# Altium project VNA_CHANNEL2.PrjPcb
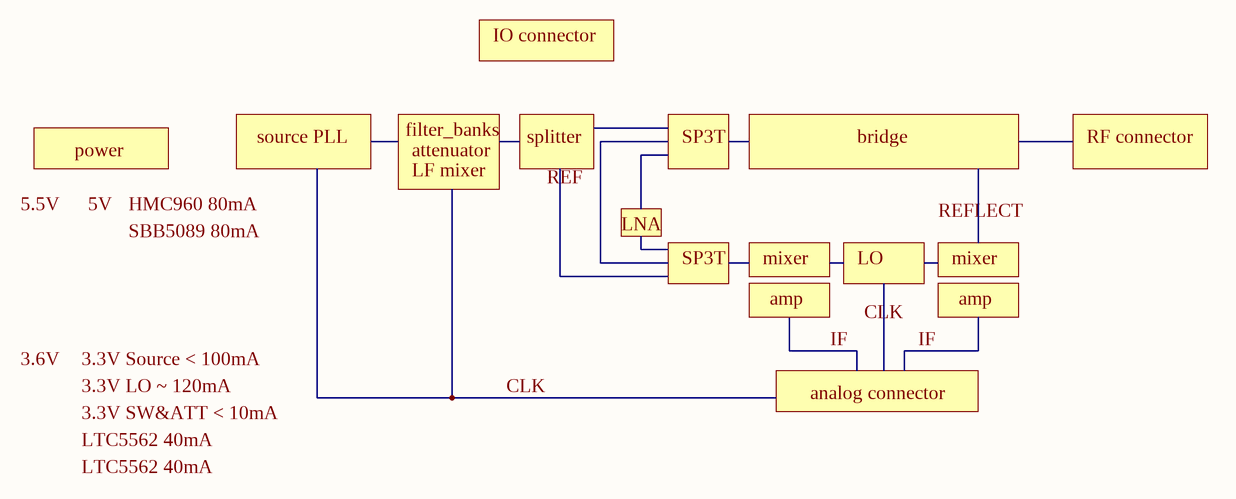
[diagram p0: block_diagram.SchDoc]
6 sheets, 107 parts. Net scope: flat (ports and power ports of the same name join across sheets).
Board file: VNA_CHANNEL2.PcbDoc
Sheets:
  block_diagram.SchDoc
  connector.SchDoc
  filterbank_amp.SchDoc
  bridge.SchDoc
  LO.SchDoc
  mixer.SchDoc

## Sheet block_diagram.SchDoc
size A4

### Notes on the sheet
- IO connector
- power
- source PLL
- filter_banks
- attenuator
- LF mixer
- splitter
- REF
- SP3T
- bridge
- RF connector
- 5.5V
- 5V
- HMC960 80mA
- SBB5089 80mA
- LNA
- mixer
- LO
- REFLECT
- amp
- CLK
- 3.6V
- 3.3V Source < 100mA
- 3.3V LO ~ 120mA
- analog connector
- IF
- LTC5562 40mA
- 3.3V SW&ATT < 10mA

## Sheet connector.SchDoc
size A4
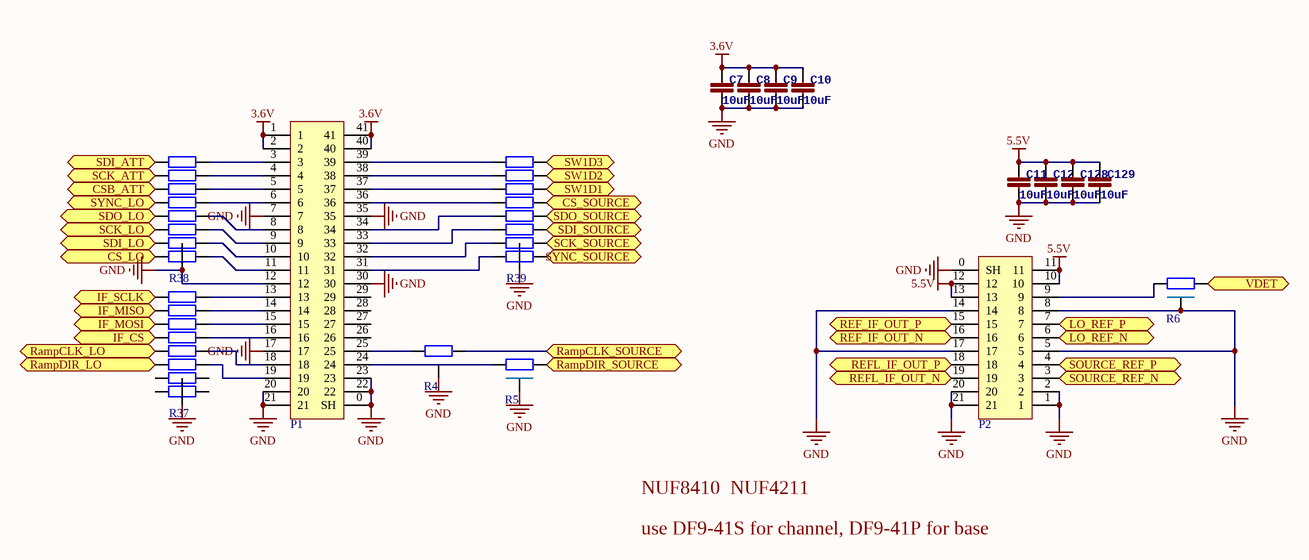
[diagram p1: connector.SchDoc]

### Parts
C7  10uF  [0603L]
C8  10uF  [0603L]
C9  10uF  [0603L]
C10  10uF  [0603L]
C11  10uF  [0603L]
C12  10uF  [0603L]
C128  10uF  [0603L]
C129  10uF  [0603L]
P1  DF9-41S  [DF9-41S]  (value not drawn)
P2  DF9-21  [DF9-21S]  (value not drawn)
R4  PiFilter  [PiFIiter]  (value not drawn)
R5  PiFilter  [PiFIiter]  (value not drawn)
R6  PiFilter  [PiFIiter]  (value not drawn)
R37  NUF8xxx  [NUF8xxx]  (value not drawn)
R38  NUF8xxx  [NUF8xxx]  (value not drawn)
R39  NUF8xxx  [NUF8xxx]  (value not drawn)

### Ports
CS_LO, CS_SOURCE, CSB_ATT, IF_CS, IF_MISO, IF_MOSI, IF_SCLK, LO_REF_N, LO_REF_P, RampCLK_LO, RampCLK_SOURCE, RampDIR_LO, RampDIR_SOURCE, REF_IF_OUT_N, REF_IF_OUT_P, REFL_IF_OUT_N, REFL_IF_OUT_P, SCK_ATT, SCK_LO, SCK_SOURCE, SDI_ATT, SDI_LO, SDI_SOURCE, SDO_LO, SDO_SOURCE, SOURCE_REF_N, SOURCE_REF_P, SW1D1, SW1D2, SW1D3, SYNC_LO, SYNC_SOURCE, VDET

### Nets
3.6V: C7.2 C8.2 C9.2 C10.2 P1.1 P1.2 P1.40 P1.41
5.5V: C11.2 C12.2 C128.2 C129.2 P2.10 P2.11 P2.12 P2.13
GND: C7.1 C8.1 C9.1 C10.1 C11.1 C12.1 C128.1 C129.1 P1.0(SH) P1.7 P1.12 P1.17 P1.20 P1.21 P1.22 P1.23 P1.30 P1.35 P2.0(SH) P2.1 P2.2 P2.5 P2.8 P2.14 P2.17 P2.20 P2.21 R4.3 R5.3 R6.3 R37.0 R38.0 R39.0
LO_REF_N: P2.6 ; port LO_REF_N
LO_REF_P: P2.7 ; port LO_REF_P
NetP1_3: P1.3 R38.16
NetP1_4: P1.4 R38.15
NetP1_5: P1.5 R38.14
NetP1_6: P1.6 R38.13
NetP1_8: P1.8 R38.12
NetP1_9: P1.9 R38.11
NetP1_10: P1.10 R38.10
NetP1_11: P1.11 R38.9
NetP1_13: P1.13 R37.16
NetP1_14: P1.14 R37.15
NetP1_15: P1.15 R37.14
NetP1_16: P1.16 R37.13
NetP1_18: P1.18 R37.12
NetP1_19: P1.19 R37.11
NetP1_24: P1.24 R5.1
NetP1_25: P1.25 R4.2
NetP1_31: P1.31 R39.8
NetP1_32: P1.32 R39.7
NetP1_33: P1.33 R39.6
NetP1_34: P1.34 R39.5
NetP1_36: P1.36 R39.4
NetP1_37: P1.37 R39.3
NetP1_38: P1.38 R39.2
NetP1_39: P1.39 R39.1
NetP2_3: P2.3 ; port SOURCE_REF_N
NetP2_4: P2.4 ; port SOURCE_REF_P
NetP2_9: P2.9 R6.2
NetP2_15: P2.15 ; port REF_IF_OUT_P
NetP2_16: P2.16 ; port REF_IF_OUT_N
NetP2_18: P2.18 ; port REFL_IF_OUT_P
NetP2_19: P2.19 ; port REFL_IF_OUT_N
NetR4_1: R4.1 ; port RampCLK_SOURCE
NetR5_2: R5.2 ; port RampDIR_SOURCE
NetR6_1: R6.1 ; port VDET
NetR37_1: R37.1 ; port IF_SCLK
NetR37_2: R37.2 ; port IF_MISO
NetR37_3: R37.3 ; port IF_MOSI
NetR37_4: R37.4 ; port IF_CS
NetR37_5: R37.5 ; port RampCLK_LO
NetR37_6: R37.6 ; port RampDIR_LO
NetR38_1: R38.1 ; port SDI_ATT
NetR38_2: R38.2 ; port SCK_ATT
NetR38_3: R38.3 ; port CSB_ATT
NetR38_4: R38.4 ; port SYNC_LO
NetR38_5: R38.5 ; port SDO_LO
NetR38_6: R38.6 ; port SCK_LO
NetR38_7: R38.7 ; port SDI_LO
NetR38_8: R38.8 ; port CS_LO
NetR39_9: R39.9 ; port SYNC_SOURCE
NetR39_10: R39.10 ; port SCK_SOURCE
NetR39_11: R39.11 ; port SDI_SOURCE
NetR39_12: R39.12 ; port SDO_SOURCE
NetR39_13: R39.13 ; port CS_SOURCE
NetR39_14: R39.14 ; port SW1D1
NetR39_15: R39.15 ; port SW1D2
NetR39_16: R39.16 ; port SW1D3

Not connected (* = marked no-connect by the designer): P1 26 27 28 29; R37 7 8 9 10

### Notes on the sheet
- use DF9-41S for channel, DF9-41P for base
- NUF8410  NUF4211

### Library data of the parts
C7-C12 C128 C129 = CAP0402-CAP: <b>Capacitor</b> / Standard 0603 ceramic capacitor, and 0.1" leaded capacitor.; PARTNO: CC0402ZRY5V7BB104

## Sheet filterbank_amp.SchDoc
size A3
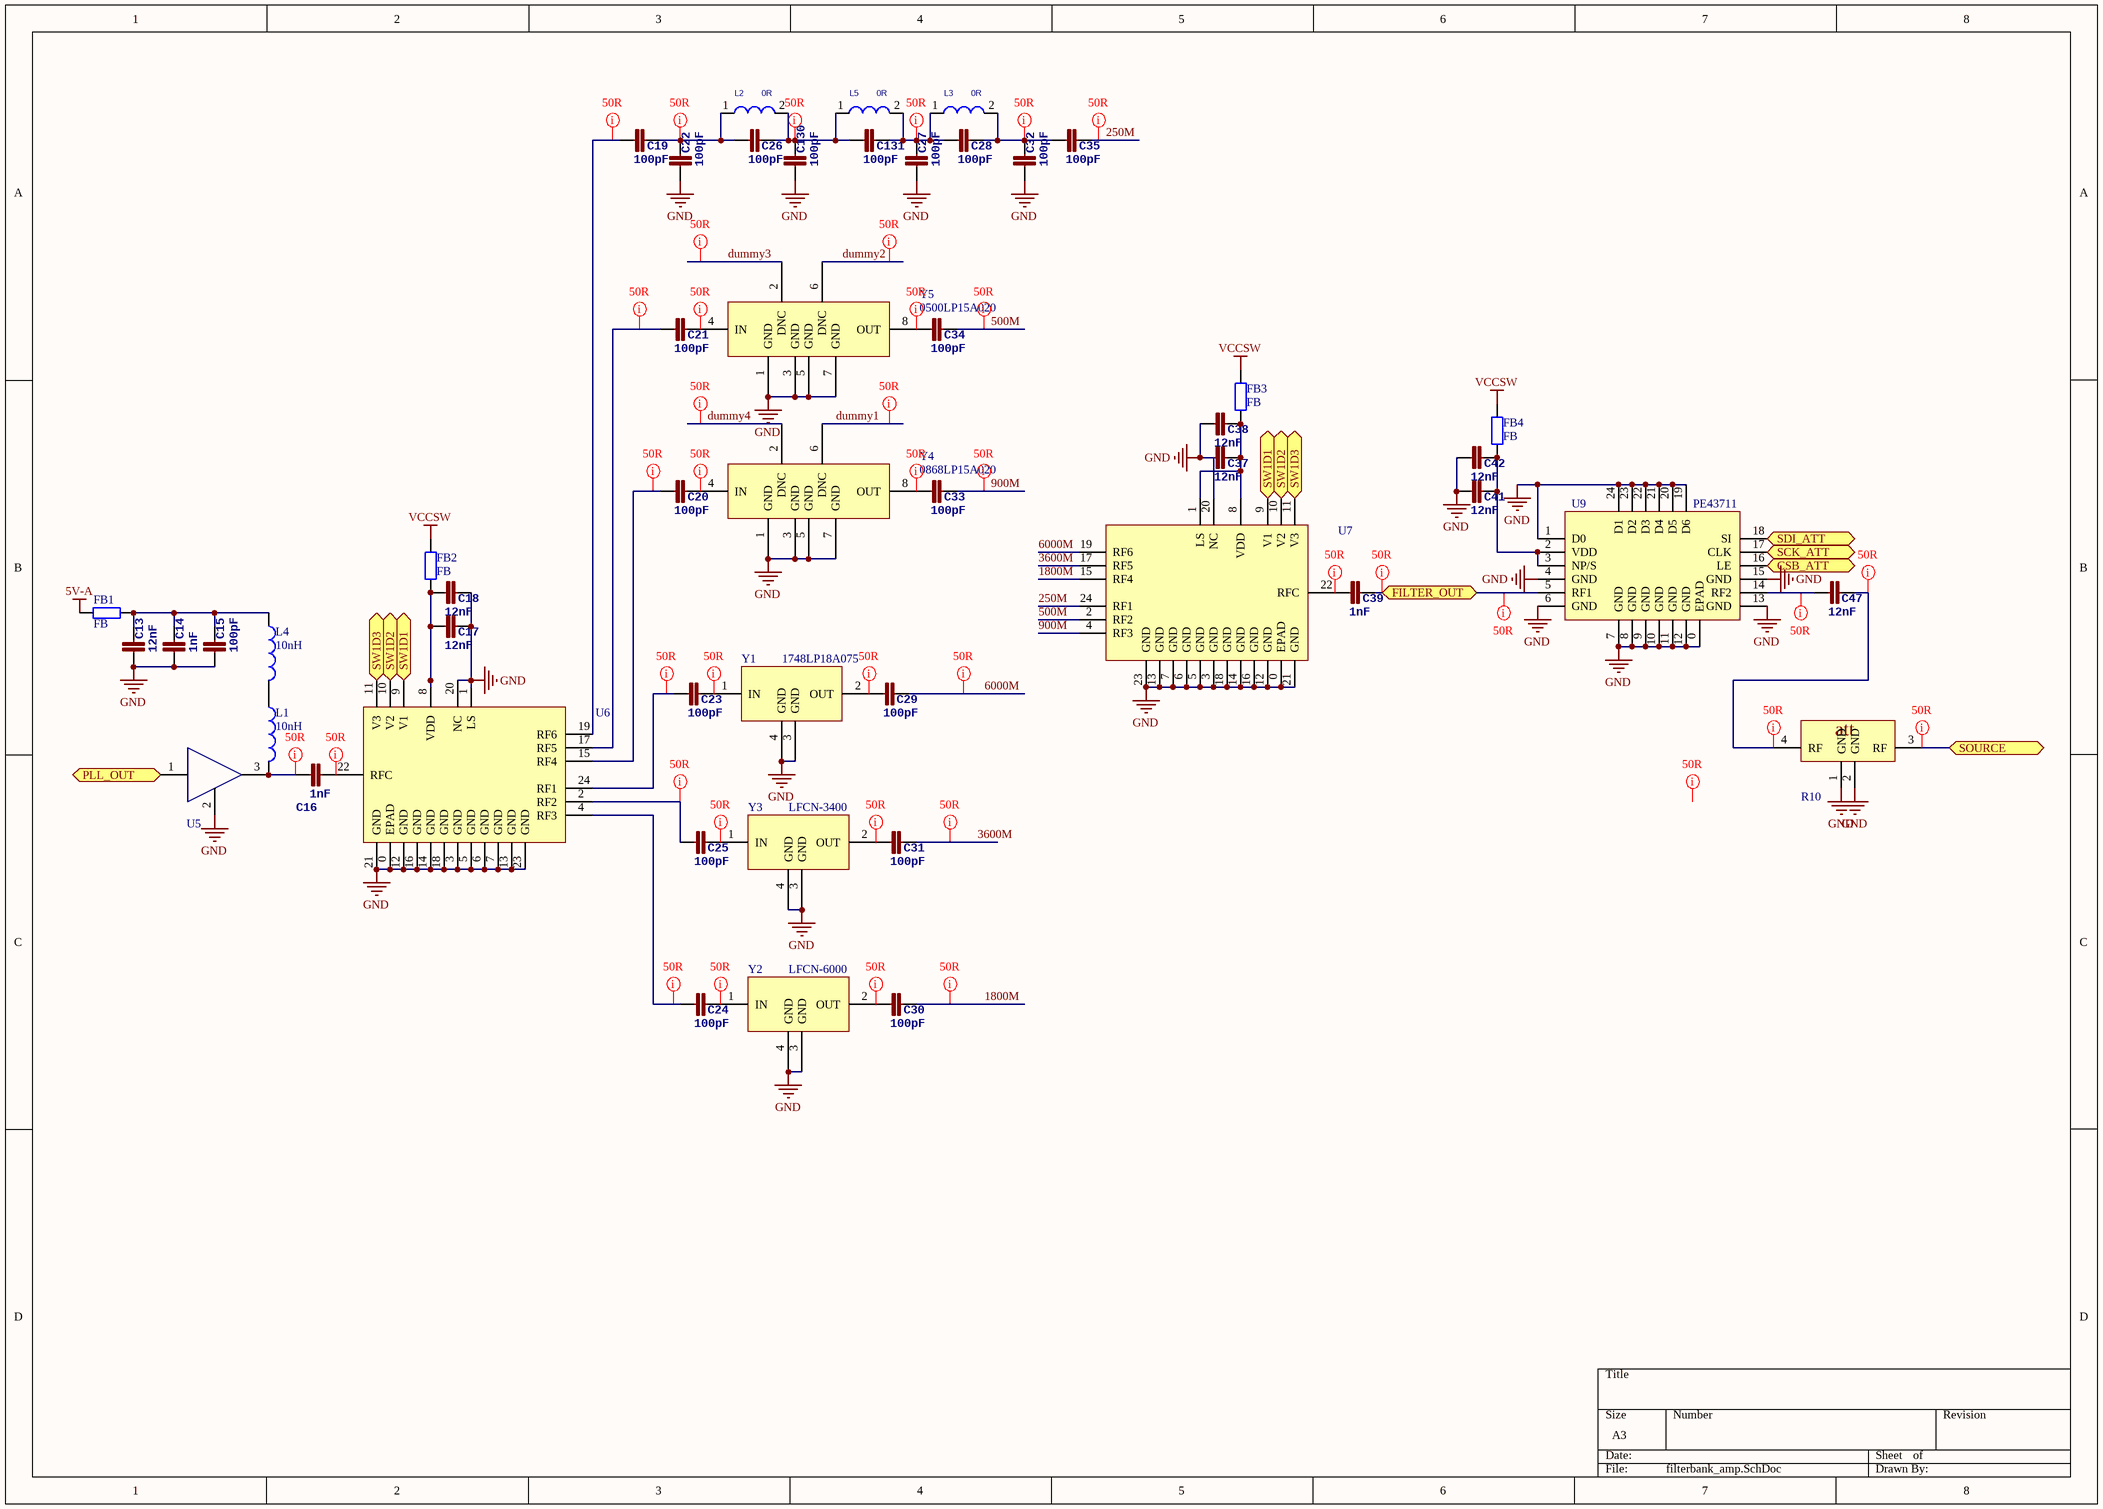
[diagram p2: filterbank_amp.SchDoc]

### Parts
C13  12nF  [0805]
C14  1nF  [0402]
C15  100pF  [0402]
C16  1nF  [0402]
C17  12nF  [0402]
C18  12nF  [0402]
C19  100pF  [0402]
C20  100pF  [0402]
C21  100pF  [0402]
C22  100pF  [0402]
C23  100pF  [0402]
C24  100pF  [0402]
C25  100pF  [0402]
C26  100pF  [0402]
C27  100pF  [0402]
C28  100pF  [0402]
C29  100pF  [0402]
C30  100pF  [0402]
C31  100pF  [0402]
C32  100pF  [0402]
C33  100pF  [0402]
C34  100pF  [0402]
C35  100pF  [0402]
C37  12nF  [0402]
C38  12nF  [0402]
C39  1nF  [0402]
C41  12nF  [0402]
C42  12nF  [0402]
C47  12nF  [0201]
C130  100pF  [0402]
C131  100pF  [0402]
FB1  FB  [0402]
FB2  FB  [0402]
FB3  FB  [0402]
FB4  FB  [0402]
L1  value 10nH  [0402]  (hidden comment: Inductor)
L2  0R  [0402]
L3  0R  [0402]
L4  value 10nH  [0603]  (hidden comment: Inductor)
L5  0R  [0402]
R10  EXB24-RF-ATT  [EXB24AT-RF-ATT]  (value not drawn)
U5  AMP-SOT89  [SOT-89]  (value not drawn)
U6  PE42462  [PE42462]  (value not drawn)
U7  PE42462  [PE42462]  (value not drawn)
U9  PE43711  [PE43711]
Y1  1748LP18A075  [1748LP18A075]
Y2  LFCN-6000  [1748LP18A075]
Y3  LFCN-3400  [1748LP18A075]
Y4  0868LP15A020  [5515LP15A730/0868LP15A020]
Y5  0500LP15A020  [5515LP15A730/0868LP15A020]

### Ports
CSB_ATT, FILTER_OUT, PLL_OUT, SCK_ATT, SDI_ATT, SOURCE, SW1D1, SW1D2, SW1D3

### Nets
5V-A: FB1.1
GND: C13.1 C14.1 C15.1 C17.2 C18.2 C22.1 C27.1 C32.1 C37.1 C38.1 C41.1 C42.1 C130.1 R10.1(GND) R10.2(GND) U5.2 U6.0(EPAD) U6.1(LS) U6.3(GND) U6.5(GND) U6.6(GND) U6.7(GND) U6.12(GND) U6.13(GND) U6.14(GND) U6.16(GND) U6.18(GND) U6.20(NC) U6.21(GND) U6.23(GND) U7.0(EPAD) U7.3(GND) U7.5(GND) U7.6(GND) U7.7(GND) U7.12(GND) U7.13(GND) U7.14(GND) U7.16(GND) U7.18(GND) U7.20(NC) U7.21(GND) U7.23(GND) U9.0(EPAD) U9.1(D0) U9.4(GND) U9.6(GND) U9.7(GND) U9.8(GND) U9.9(GND) U9.10(GND) U9.11(GND) U9.12(GND) U9.13(GND) U9.15(GND) U9.19(D6) U9.20(D5) U9.21(D4) U9.22(D3) U9.23(D2) U9.24(D1) Y1.3(GND) Y1.4(GND) Y2.3(GND) Y2.4(GND) Y3.3(GND) Y3.4(GND) Y4.1(GND) Y4.3(GND) Y4.5(GND) Y4.7(GND) Y5.1(GND) Y5.3(GND) Y5.5(GND) Y5.7(GND)
VCCSW: FB2.2 FB3.2 FB4.2
250M: C35.2 U7.24(RF1)
500M: C34.2 U7.2(RF2)
900M: C33.2 U7.4(RF3)
1800M: C30.2 U7.15(RF4)
3600M: C31.2 U7.17(RF5)
6000M: C29.2 U7.19(RF6)
dummy1: Y4.6(DNC)
dummy2: Y5.6(DNC)
dummy3: Y5.2(DNC)
dummy4: Y4.2(DNC)
NetB1_SOURCE: R10.3(RF) ; port SOURCE
NetC13_2: C13.2 C14.2 C15.2 FB1.2 L4.1
NetC16_1: C16.1 L1.2 U5.3
NetC16_2: C16.2 U6.22(RFC)
NetC17_1: C17.1 C18.1 FB2.1 U6.8(VDD)
NetC19_1: C19.1 U6.19(RF6)
NetC19_2: C19.2 C22.2 C26.1 L2.1
NetC20_1: C20.1 U6.15(RF4)
NetC20_2: C20.2 Y4.4(IN)
NetC21_1: C21.1 U6.17(RF5)
NetC21_2: C21.2 Y5.4(IN)
NetC23_1: C23.1 U6.24(RF1)
NetC23_2: C23.2 Y1.1(IN)
NetC24_1: C24.1 U6.4(RF3)
NetC24_2: C24.2 Y2.1(IN)
NetC25_1: C25.1 U6.2(RF2)
NetC25_2: C25.2 Y3.1(IN)
NetC26_2: C26.2 C130.2 C131.1 L2.2 L5.1
NetC27_2: C27.2 C28.1 C131.2 L3.1 L5.2
NetC28_2: C28.2 C32.2 C35.1 L3.2
NetC29_1: C29.1 Y1.2(OUT)
NetC30_1: C30.1 Y2.2(OUT)
NetC31_1: C31.1 Y3.2(OUT)
NetC33_1: C33.1 Y4.8(OUT)
NetC34_1: C34.1 Y5.8(OUT)
NetC37_2: C37.2 C38.2 FB3.1 U7.1(LS) U7.8(VDD)
NetC39_1: C39.1 U7.22(RFC)
NetC39_2: C39.2 U9.5(RF1) ; port FILTER_OUT
NetC41_2: C41.2 C42.2 FB4.1 U9.2(VDD) U9.3(NP/S)
NetC47_1: C47.1 U9.14(RF2)
NetC47_2: C47.2 R10.4(RF)
NetL1_1: L1.1 L4.2
NetR38_1: U9.18(SI) ; port SDI_ATT
NetR38_2: U9.17(CLK) ; port SCK_ATT
NetR38_3: U9.16(LE) ; port CSB_ATT
NetR39_14: U6.9(V1) U7.9(V1) ; port SW1D1
NetR39_15: U6.10(V2) U7.10(V2) ; port SW1D2
NetR39_16: U6.11(V3) U7.11(V3) ; port SW1D3
NetU5_1: U5.1 ; port PLL_OUT

### Layout directives
net class 50R: 250M, 500M, 900M, 1800M, 3600M, 6000M, (no net found under the mark), dummy1, dummy2, dummy3, dummy4, NetB1_SOURCE, NetC16_1, NetC16_2, NetC19_1, NetC19_2, NetC20_1, NetC20_2, NetC21_1, NetC21_2, NetC23_1, NetC23_2, NetC24_1, NetC24_2, NetC25_1, NetC25_2, NetC26_2, NetC27_2, NetC28_2, NetC29_1, NetC30_1, NetC31_1, NetC33_1, NetC34_1, NetC39_1, NetC39_2, NetC47_1, NetC47_2

### Notes on the sheet
- (in symbol EXB24-RF-ATT) att

### Library data of the parts
C13-C35 C37-C39 C41 C42 C47 C130 C131 = CAP0402-CAP: as C7 on sheet connector
FB1-FB4 = Res2: Resistor; Published: 8-Jun-2000; LatestRevisionDate: 17-Jul-2002; LatestRevisionNote: Re-released for DXP Platform.; PackageReference: AXIAL-0.4; Publisher: Altium Limited; PackageDescription: Axial Device, Thru-Hole; 2 Leads; 0.4 in Pin Spacing
L1 L4 = Inductor: Code_IEC: 1005; Published: 8-Jun-2000; LatestRevisionDate: 29-May-2009; LatestRevisionNote: IPC-7351 Footprint Added.; PackageReference: 0402-A; Publisher: Altium Limited; PackageDescription: Chip Inductor; Code_JEITA: 0402
L2 L3 L5 = L/2.5*2.0
Y2 Y3 = 1748LP18A075
Y4 Y5 = 5515LP15A730/0868LP15A020

## Sheet bridge.SchDoc
size A4
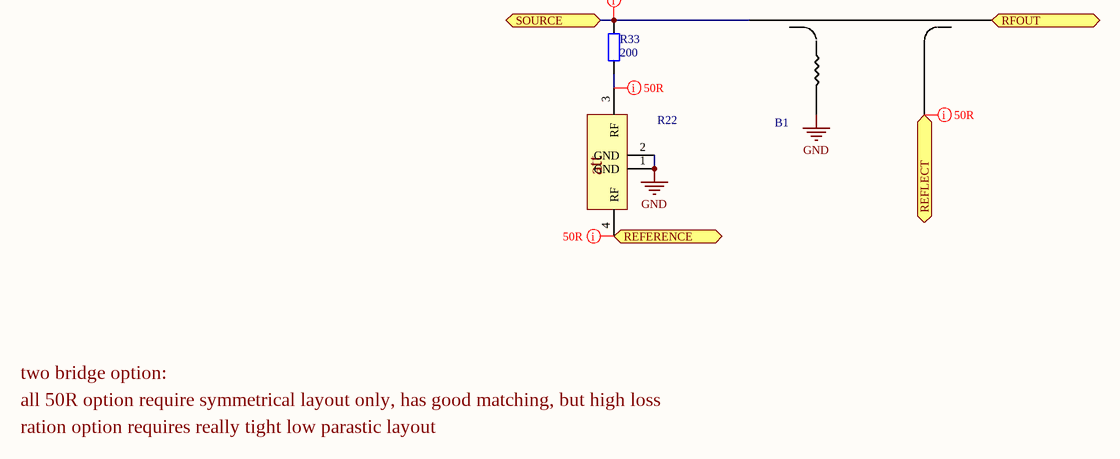
[diagram p3: bridge.SchDoc]

### Parts
B1  BRIDGE  [BRIDGE-4]  (value not drawn)
R22  EXB24-RF-ATT  [EXB24AT-RF-ATT]  (value not drawn)
R33  200  [0201]

### Ports
REFERENCE, REFLECT, RFOUT, SOURCE

### Nets
GND: B1.GND R22.1(GND) R22.2(GND)
NetB1_COUPLE: B1.COUPLE ; port REFLECT
NetB1_OUT: B1.OUT ; port RFOUT
NetB1_SOURCE: B1.SOURCE R33.2 ; port SOURCE
NetC71_1: R22.4(RF) ; port REFERENCE
NetR22_3: R22.3(RF) R33.1

### Layout directives
net class 50R: NetB1_COUPLE, NetB1_SOURCE, NetC71_1, NetR22_3

### Notes on the sheet
- two bridge option:
- all 50R option require symmetrical layout only, has good matching, but high loss
- ration option requires really tight low parastic layout
- (in symbol EXB24-RF-ATT) att

### Library data of the parts
R33 = Res2: Resistor; Published: 8-Jun-2000; LatestRevisionDate: 17-Jul-2002; LatestRevisionNote: Re-released for DXP Platform.; PackageReference: AXIAL-0.4; Publisher: Altium Limited; PackageDescription: Axial Device, Thru-Hole; 2 Leads; 0.4 in Pin Spacing

## Sheet LO.SchDoc
size A4
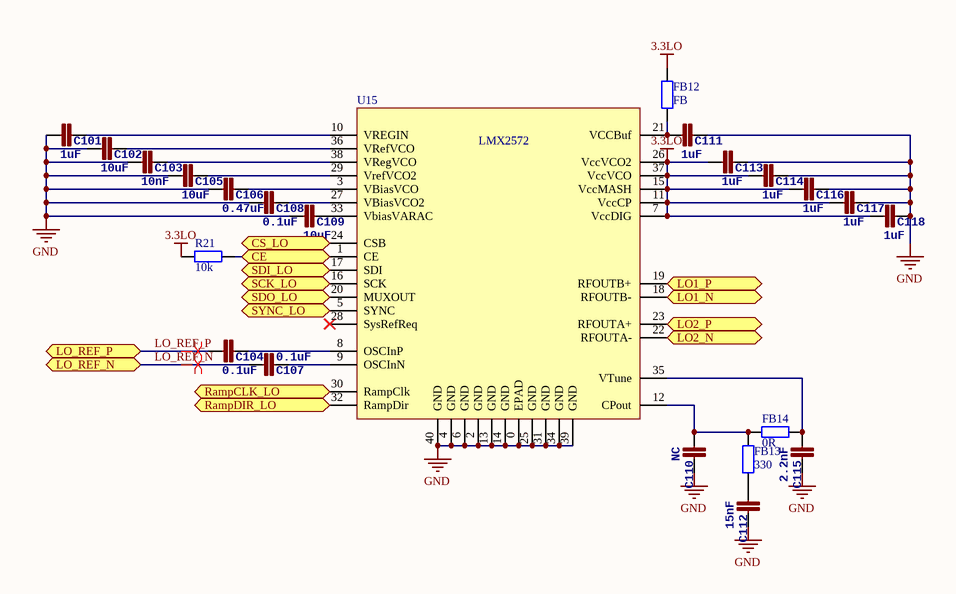
[diagram p4: LO.SchDoc]

### Parts
C101  1uF  [0201]
C102  10uF  [0402]
C103  10nF  [0201]
C104  0.1uF  [0201]
C105  10uF  [0402]
C106  0.47uF  [0402]
C107  0.1uF  [0201]
C108  0.1uF  [0201]
C109  10uF  [0402]
C110  NC  [0201]
C111  1uF  [0201]
C112  15nF  [0201]
C113  1uF  [0201]
C114  1uF  [0201]
C115  2.2nF  [0201]
C116  1uF  [0201]
C117  1uF  [0201]
C118  1uF  [0201]
FB12  FB  [0402]
FB13  330  [0201]
FB14  0R  [0201]
R21  10k  [0402]
U15  LMX2572  [LMX2572]

### Ports
CE, CS_LO, LO1_N, LO1_P, LO2_N, LO2_P, LO_REF_N, LO_REF_P, RampCLK_LO, RampDIR_LO, SCK_LO, SDI_LO, SDO_LO, SYNC_LO

### Nets
3.3LO: C113.1 C114.1 C116.1 C117.1 C118.1 FB12.1 R21.1 U15.7(VccDIG) U15.11(VccCP) U15.15(VccMASH) U15.26(VccVCO2) U15.37(VccVCO)
GND: C101.1 C102.1 C103.1 C105.1 C106.1 C108.1 C109.1 C110.2 C111.2 C112.2 C113.2 C114.2 C115.2 C116.2 C117.2 C118.2 U15.0(EPAD) U15.2(GND) U15.4(GND) U15.6(GND) U15.13(GND) U15.14(GND) U15.25(GND) U15.31(GND) U15.34(GND) U15.39(GND) U15.40(GND)
LO1_N: U15.18(RFOUTB-) ; port LO1_N
LO1_P: U15.19(RFOUTB+) ; port LO1_P
LO2_N: U15.22(RFOUTA-) ; port LO2_N
LO2_P: U15.23(RFOUTA+) ; port LO2_P
LO_REF_N: C107.1 ; port LO_REF_N
LO_REF_P: C104.1 ; port LO_REF_P
NetC101_2: C101.2 U15.10(VREGIN)
NetC102_2: C102.2 U15.36(VRefVCO)
NetC103_2: C103.2 U15.38(VRegVCO)
NetC104_2: C104.2 U15.8(OSCInP)
NetC105_2: C105.2 U15.29(VrefVCO2)
NetC106_2: C106.2 U15.3(VBiasVCO)
NetC107_2: C107.2 U15.9(OSCInN)
NetC108_2: C108.2 U15.27(VBiasVCO2)
NetC109_2: C109.2 U15.33(VbiasVARAC)
NetC110_1: C110.1 FB13.2 FB14.2 U15.12(CPout)
NetC111_1: C111.1 FB12.2 U15.21(VCCBuf)
NetC112_1: C112.1 FB13.1
NetC115_1: C115.1 FB14.1 U15.35(VTune)
NetR21_2: R21.2 U15.1(CE) ; port CE
NetR37_5: U15.30(RampClk) ; port RampCLK_LO
NetR37_6: U15.32(RampDir) ; port RampDIR_LO
NetR38_4: U15.5(SYNC) ; port SYNC_LO
NetR38_5: U15.20(MUXOUT) ; port SDO_LO
NetR38_6: U15.16(SCK) ; port SCK_LO
NetR38_7: U15.17(SDI) ; port SDI_LO
NetR38_8: U15.24(CSB) ; port CS_LO

Not connected (* = marked no-connect by the designer): U15 28(SysRefReq)*

### Layout directives
differential pair: LO_REF_N, LO_REF_P

### Library data of the parts
C101-C118 = CAP0402-CAP: as C7 on sheet connector
FB12-FB14 R21 = Res2: Resistor; Published: 8-Jun-2000; LatestRevisionDate: 17-Jul-2002; LatestRevisionNote: Re-released for DXP Platform.; PackageReference: AXIAL-0.4; Publisher: Altium Limited; PackageDescription: Axial Device, Thru-Hole; 2 Leads; 0.4 in Pin Spacing

## Sheet mixer.SchDoc
size A4
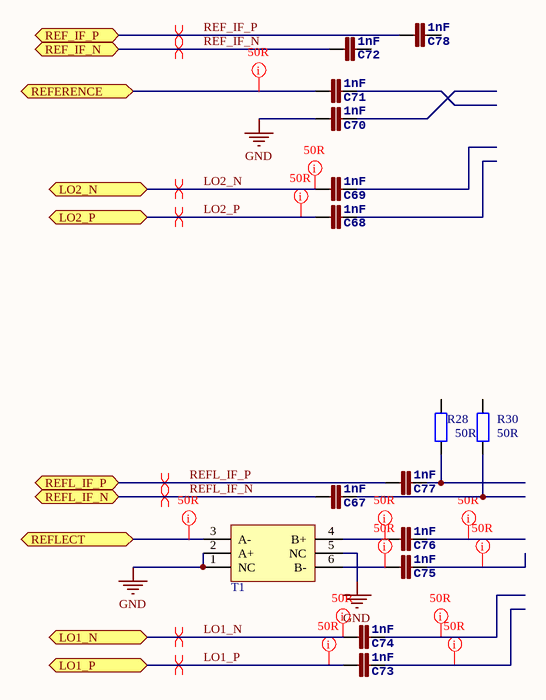
[diagram p5: mixer.SchDoc]

### Parts
C67  1nF  [0402]
C68  1nF  [0402]
C69  1nF  [0402]
C70  1nF  [0402]
C71  1nF  [0402]
C72  1nF  [0402]
C73  1nF  [0402]
C74  1nF  [0402]
C75  1nF  [0402]
C76  1nF  [0402]
C77  1nF  [0402]
C78  1nF  [0402]
R28  50R  [0402]
R30  50R  [0402]
T1  TCM1-63AX+  [TCM1-63AX+]  (value not drawn)

### Ports
LO1_N, LO1_P, LO2_N, LO2_P, REF_IF_N, REF_IF_P, REFERENCE, REFL_IF_N, REFL_IF_P, REFLECT

### Nets
GND: C70.1 T1.1(NC) T1.2(A+) T1.5(NC)
LO1_N: C74.1 ; port LO1_N
LO1_P: C73.1 ; port LO1_P
LO2_N: C69.1 ; port LO2_N
LO2_P: C68.1 ; port LO2_P
REF_IF_N: C72.1 ; port REF_IF_N
REF_IF_P: C78.1 ; port REF_IF_P
REFL_IF_N: C67.1 ; port REFL_IF_N
REFL_IF_P: C77.1 ; port REFL_IF_P
NetB1_COUPLE: T1.3(A-) ; port REFLECT
NetC67_2: C67.2 R30.1
NetC71_1: C71.1 ; port REFERENCE
NetC75_1: C75.1 T1.6(B-)
NetC76_1: C76.1 T1.4(B+)
NetC77_2: C77.2 R28.1

Not connected (* = marked no-connect by the designer): C68 2; C69 2; C70 2; C71 2; C72 2; C73 2; C74 2; C75 2; C76 2; C78 2; R28 2; R30 2

### Layout directives
differential pair: LO1_N, LO1_P, LO2_N, LO2_P, REF_IF_N, REF_IF_P, REFL_IF_N, REFL_IF_P
net class 50R: LO1_N, LO1_P, LO2_N, LO2_P, NetB1_COUPLE, NetC71_1, NetC73_2, NetC74_2, NetC75_1, NetC75_2, NetC76_1, NetC76_2

### Library data of the parts
C67-C78 = CAP0402-CAP: as C7 on sheet connector
R28 R30 = Res2: Resistor; Published: 8-Jun-2000; LatestRevisionDate: 17-Jul-2002; LatestRevisionNote: Re-released for DXP Platform.; PackageReference: AXIAL-0.4; Publisher: Altium Limited; PackageDescription: Axial Device, Thru-Hole; 2 Leads; 0.4 in Pin Spacing

## Nets that join several sheets
GND: connector (33 pins), filterbank_amp (75 pins), bridge (B1.GND R22.1 R22.2), LO (27 pins), mixer (C70.1 T1.1 T1.2 T1.5)
LO1_N: LO (U15.18), mixer (C74.1)
LO1_P: LO (U15.19), mixer (C73.1)
LO2_N: LO (U15.22), mixer (C69.1)
LO2_P: LO (U15.23), mixer (C68.1)
LO_REF_N: connector (P2.6), LO (C107.1)
LO_REF_P: connector (P2.7), LO (C104.1)
NetB1_COUPLE: bridge (B1.COUPLE), mixer (T1.3)
NetB1_SOURCE: filterbank_amp (R10.3), bridge (B1.SOURCE R33.2)
NetC71_1: bridge (R22.4), mixer (C71.1)
NetR37_5: connector (R37.5), LO (U15.30)
NetR37_6: connector (R37.6), LO (U15.32)
NetR38_1: connector (R38.1), filterbank_amp (U9.18)
NetR38_2: connector (R38.2), filterbank_amp (U9.17)
NetR38_3: connector (R38.3), filterbank_amp (U9.16)
NetR38_4: connector (R38.4), LO (U15.5)
NetR38_5: connector (R38.5), LO (U15.20)
NetR38_6: connector (R38.6), LO (U15.16)
NetR38_7: connector (R38.7), LO (U15.17)
NetR38_8: connector (R38.8), LO (U15.24)
NetR39_14: connector (R39.14), filterbank_amp (U6.9 U7.9)
NetR39_15: connector (R39.15), filterbank_amp (U6.10 U7.10)
NetR39_16: connector (R39.16), filterbank_amp (U6.11 U7.11)